# EAGLE design asaMain7_out4 (EAGLE 7.4.0)
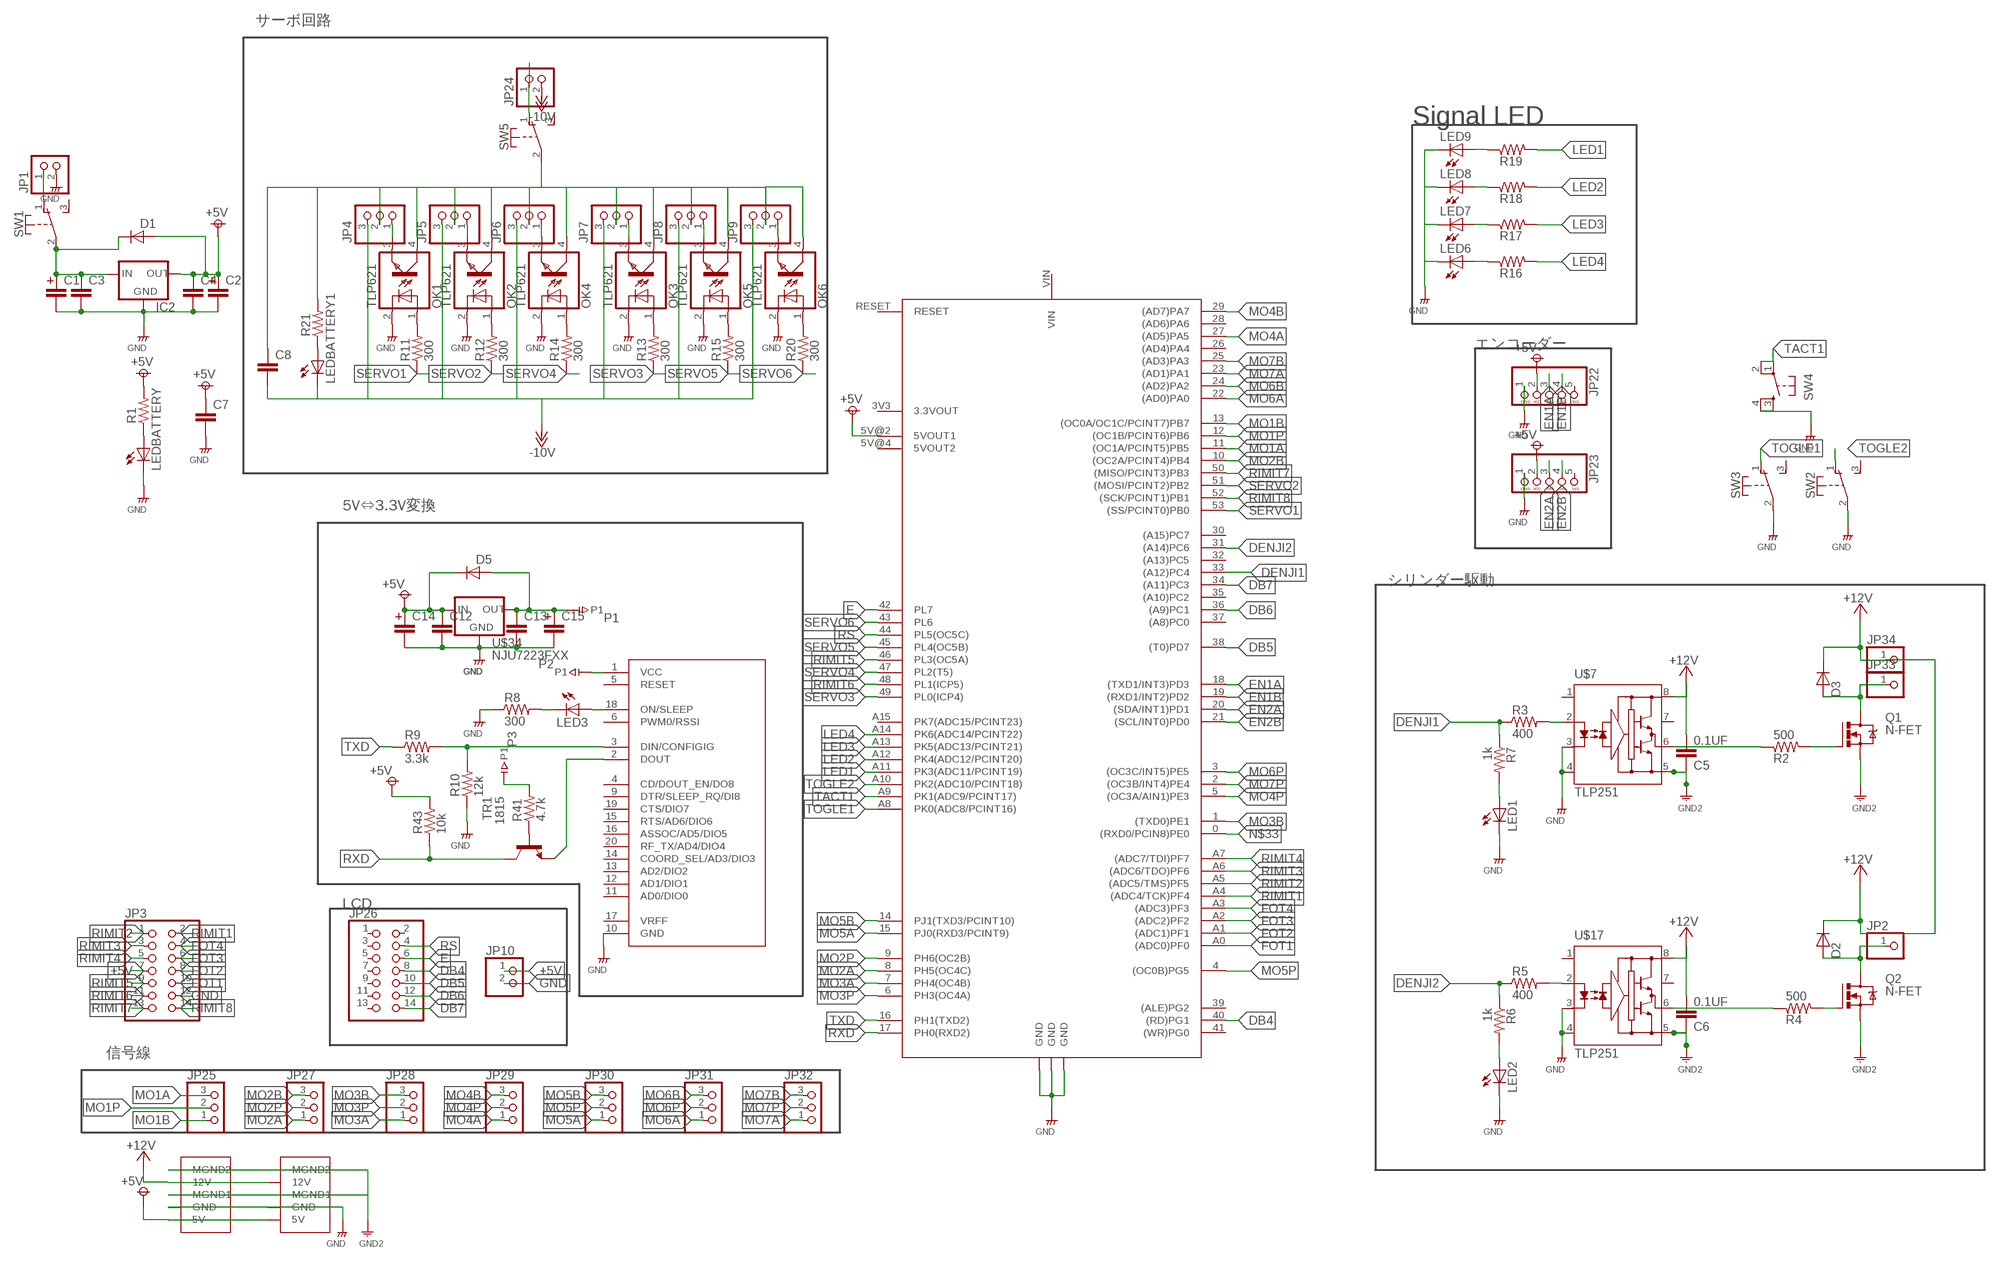
[diagram p0: schematic, sheet 1]

## Parts
AR1  ARUDUINO_MEGA_2560_R3  [ARUDUINO_MEGA_2560_R3]
C1  CAPACITOR-330U_SMD  [C_330U_SMD]
C2  CAPACITOR-330U_SMD  [C_330U_SMD]
C3  MLCC-3  [MLCC_50]
C4  MLCC-3  [MLCC_50]
C5  0.1UF  MLCC-3  [MLCC_50]
C6  0.1UF  MLCC-3  [MLCC_50]
C7  MLCC-3  [MLCC_50]
C8  MLCC-3  [MLCC_50]
C12  MLCC-3  [MLCC_50]
C13  MLCC-3  [MLCC_50]
C14  CAPACITOR-330U_SMD  [C_330U_SMD]
C15  CAPACITOR-330U_SMD  [C_330U_SMD]
D1  DIODE_3  [DIODE_3]
D2  DIODE_4  [DIODE_4]
D3  DIODE_4  [DIODE_4]
D5  DIODE_3  [DIODE_3]
IC2  78  [78XX]
JP1  PINHD-1X2"  [1*02]
JP2  PINHD-1X1  [1X01]
JP3  PINHD-2X7  [2X07]
JP4  PINHD-1X3-1  [1*03]
JP5  PINHD-1X3-1  [1*03]
JP6  PINHD-1X3-1  [1*03]
JP7  PINHD-1X3-1  [1*03]
JP8  PINHD-1X3-1  [1*03]
JP9  PINHD-1X3-1  [1*03]
JP10  PINHD-1X2"  [1*02]
JP22  PINHD-1X5-1  [1*05(KIKAKU)]
JP23  PINHD-1X5-1  [1*05(KIKAKU)]
JP24  PINHD-1X2"  [1*02]
JP25  PINHD-1X3-1  [1*03]
JP26  PINHD-2X7  [2X07]
JP27  PINHD-1X3-1  [1*03]
JP28  PINHD-1X3-1  [1*03]
JP29  PINHD-1X3-1  [1*03]
JP30  PINHD-1X3-1  [1*03]
JP31  PINHD-1X3-1  [1*03]
JP32  PINHD-1X3-1  [1*03]
JP33  PINHD-1X1  [1X01]
JP34  PINHD-1X1  [1X01]
LED1  LED3MM  [LED3MM]
LED2  LED3MM  [LED3MM]
LED3  LED3MM  [LED3MM]
LED6  LED3MM  [LED3MM]
LED7  LED3MM  [LED3MM]
LED8  LED3MM  [LED3MM]
LED9  LED3MM  [LED3MM]
LEDBATTERY  LED3MM_2  [LED3MM_2]
LEDBATTERY1  LED3MM  [LED3MM]
OK1  TLP621  [DIP4]
OK2  TLP621  [DIP4]
OK3  TLP621  [DIP4]
OK4  TLP621  [DIP4]
OK5  TLP621  [DIP4]
OK6  TLP621  [DIP4]
Q1  N-FET  [TO-220V]
Q2  N-FET  [TO-220V]
R1  RESISTORS3216  [3216]
R2  500  RESISTORS-3  [R_0.3]
R3  400  RESISTORS3216  [3216]
R4  500  RESISTORS-3  [R_0.3]
R5  400  RESISTORS3216  [3216]
R6  1k  RESISTORS3216  [3216]
R7  1k  RESISTORS3216  [3216]
R8  300  RESISTORS-3  [R_0.3]
R9  3.3k  RESISTORS4  [R_0.4]
R10  12k  RESISTORS4  [R_0.4]
R11  300  RESISTORS3216  [3216]
R12  300  RESISTORS3216  [3216]
R13  300  RESISTORS3216  [3216]
R14  300  RESISTORS3216  [3216]
R15  300  RESISTORS3216  [3216]
R16  RESISTORS3216  [3216]
R17  RESISTORS3216  [3216]
R18  RESISTORS3216  [3216]
R19  RESISTORS3216  [3216]
R20  300  RESISTORS3216  [3216]
R21  RESISTORS3216  [3216]
R41  4.7k  RESISTORS-3  [R_0.3]
R43  10k  RESISTORS-3  [R_0.3]
SW1  TOGGLE  [9450-2]
SW2  TOGGLE  [9450-2]
SW3  TOGGLE  [9450-2]
SW4  TACT  [1273]
SW5  TOGGLE  [9450-2]
TR1  1815  [GSPACE]
U$7  TLP251  [DIP8]
U$17  TLP251  [DIP8]
U$28  ASADORA2017A  [ASADORA2017A]
U$34  NJU7223FXX  [NJU7223FXX]
U$45  ASADORA2017A  [ASADORA2017A]
XB1  XBEE-  [XBEE-MAIN]

## Nets
3.3OUT: C13.1 C15.PLUS D5.A R41.2 U$34.P$1(OUT) XB1.1(VCC) ; supply symbol labelled CPIN
+5V: AR1.5V@2(5VOUT1) C2.PLUS C4.1 C7.1 C12.1 C14.PLUS D1.A D5.C IC2.P$3(OUT) JP3.7 JP10.1 JP22.2 JP23.2 R1.P$6 R43.2 U$28.5V U$34.P$2(IN) U$45.5V
+12V: C5.2 C6.2 D2.C D3.C JP34.1 U$7.8 U$17.8 U$28.12V U$45.12V
-10V: C8.2 JP4.3 JP5.3 JP6.3 JP7.3 JP8.3 JP9.3 JP24.2 LEDBATTERY1.K(C)
DB4: AR1.40((RD)PG1) JP26.8
DB5: AR1.38((T0)PD7) JP26.10
DB6: AR1.36((A9)PC1) JP26.12
DB7: AR1.34((A11)PC3) JP26.14
DENJI1: AR1.33((A12)PC4) R3.P$5 R7.P$5
DENJI2: AR1.31((A14)PC6) R5.P$5 R6.P$5
E: AR1.42(PL7) JP26.6
EN1A: AR1.18((TXD1/INT3)PD3) JP22.3
EN1B: AR1.19((RXD1/INT2)PD2) JP22.4
EN2A: AR1.20((SDA/INT1)PD1) JP23.3
EN2B: AR1.21((SCL/INT0)PD0) JP23.4
FOT1: AR1.A0((ADC0)PF0) JP3.10
FOT2: AR1.A1((ADC1)PF1) JP3.8
FOT3: AR1.A2((ADC2)PF2) JP3.6
FOT4: AR1.A3((ADC3)PF3) JP3.4
GND: AR1.GND@1(GND) AR1.GND@3(GND) AR1.GND@5(GND) C1.MINUS C2.MINUS C3.2 C4.2 C7.2 C12.2 C13.2 C14.MINUS C15.MINUS IC2.P$2(GND) JP1.2 JP3.12 JP10.2 JP22.1 JP23.1 LED1.K(C) LED2.K(C) LED6.K(C) LED7.K(C) LED8.K(C) LED9.K(C) LEDBATTERY.K(C) OK1.2(C) OK2.2(C) OK3.2(C) OK4.2(C) OK5.2(C) OK6.2(C) R8.1 R10.1 SW2.2(P) SW3.2(P) SW4.3(S) SW4.4(S1) U$7.3 U$7.4 U$17.3 U$17.4 U$28.GND U$34.P$3(GND) U$45.GND XB1.10(GND)
GND12: C5.1 C6.1 Q1.3(S) Q2.3(S) U$7.5 U$17.5 U$28.MGND1 U$28.MGND2 U$45.MGND1 U$45.MGND2 ; supply symbol labelled GND2
LED1: AR1.A11(PK3(ADC11/PCINT19)) R19.P$6
LED2: AR1.A12(PK4(ADC12/PCINT20)) R18.P$6
LED3: AR1.A13(PK5(ADC13/PCINT21)) R17.P$6
LED4: AR1.A14(PK6(ADC14/PCINT22)) R16.P$6
MO1A: AR1.11((OC1A/PCINT5)PB5) JP25.3
MO1B: AR1.13((OC0A/OC1C/PCINT7)PB7) JP25.1
MO1P: AR1.12((OC1B/PCINT6)PB6) JP25.2
MO2A: AR1.8(PH5(OC4C)) JP27.1
MO2B: AR1.10((OC2A/PCINT4)PB4) JP27.3
MO2P: AR1.9(PH6(OC2B)) JP27.2
MO3A: AR1.7(PH4(OC4B)) JP28.1
MO3B: AR1.1((TXD0)PE1) JP28.3
MO3P: AR1.6(PH3(OC4A)) JP28.2
MO4A: AR1.27((AD5)PA5) JP29.1
MO4B: AR1.29((AD7)PA7) JP29.3
MO4P: AR1.5((OC3A/AIN1)PE3) JP29.2
MO5A: AR1.15(PJ0(RXD3/PCINT9)) JP30.1
MO5B: AR1.14(PJ1(TXD3/PCINT10)) JP30.3
MO5P: AR1.4((OC0B)PG5) JP30.2
MO6A: AR1.22((AD0)PA0) JP31.1
MO6B: AR1.24((AD2)PA2) JP31.3
MO6P: AR1.3((OC3C/INT5)PE5) JP31.2
MO7A: AR1.23((AD1)PA1) JP32.1
MO7B: AR1.25((AD3)PA3) JP32.3
MO7P: AR1.2((OC3B/INT4)PE4) JP32.2
N$1: LED9.A R19.P$5
N$2: LED8.A R18.P$5
N$3: OK1.1(A) R11.P$6
N$4: JP1.1 SW1.1(O)
N$5: C1.PLUS C3.1 D1.C IC2.P$1(IN) SW1.2(P)
N$6: Q1.1(G) R2.2
N$8: Q2.1(G) R4.2
N$9: LED7.A R17.P$5
N$10: R3.P$6 U$7.2
N$11: R2.1 U$7.6
N$12: OK2.1(A) R12.P$6
N$13: LED1.A R7.P$6
N$15: R4.1 U$17.6
N$16: LEDBATTERY1.A R21.P$5
N$17: LED6.A R16.P$5
N$19: LED2.A R6.P$6
N$20: R5.P$6 U$17.2
N$21: D2.A JP2.1 Q2.2(D)
N$23: JP7.1 OK3.3(EMIT)
N$24: JP8.1 OK5.3(EMIT)
N$26: JP4.1 OK1.3(EMIT)
N$27: OK3.1(A) R13.P$6
N$28: JP5.1 OK2.3(EMIT)
N$29: OK5.1(A) R15.P$6
N$30: JP9.1 OK6.3(EMIT)
N$31: OK6.1(A) R20.P$6
N$32: JP6.1 OK4.3(EMIT)
N$33: AR1.0((RXD0/PCIN8)PE0)
N$34: OK4.1(A) R14.P$6
N$36: D3.A JP33.1 Q1.2(D)
N$40: LEDBATTERY.A R1.P$5
N$51: LED3.A XB1.18(ON/SLEEP)
N$54: LED3.K(C) R8.2
N$59: C8.1 JP4.2 JP5.2 JP6.2 JP7.2 JP8.2 JP9.2 OK1.4(COL) OK2.4(COL) OK3.4(COL) OK4.4(COL) OK5.4(COL) OK6.4(COL) R21.P$6 SW5.2(P)
N$68: R9.2 R10.2 XB1.3(DIN/CONFIGIG)
N$81: JP24.1 SW5.1(O)
N$103: R41.1 TR1.B
N$104: TR1.E XB1.2(DOUT)
RIMIT1: AR1.A4((ADC4/TCK)PF4) JP3.2
RIMIT2: AR1.A5((ADC5/TMS)PF5) JP3.1
RIMIT3: AR1.A6((ADC6/TDO)PF6) JP3.3
RIMIT4: AR1.A7((ADC7/TDI)PF7) JP3.5
RIMIT5: AR1.46(PL3(OC5A)) JP3.9
RIMIT6: AR1.48(PL1(ICP5)) JP3.11
RIMIT7: AR1.50((MISO/PCINT3)PB3) JP3.13
RIMIT8: AR1.52((SCK/PCINT1)PB1) JP3.14
RS: AR1.44(PL5(OC5C)) JP26.4
RXD: AR1.17(PH0(RXD2)) R43.1 TR1.C
SERVO1: AR1.53((SS/PCINT0)PB0) R11.P$5
SERVO2: AR1.51((MOSI/PCINT2)PB2) R12.P$5
SERVO3: AR1.49(PL0(ICP4)) R13.P$5
SERVO4: AR1.47(PL2(T5)) R14.P$5
SERVO5: AR1.45(PL4(OC5B)) R15.P$5
SERVO6: AR1.43(PL6) R20.P$5
TACT1: AR1.A9(PK1(ADC9/PCINT17)) SW4.1(P) SW4.2(P1)
TOGLE1: AR1.A8(PK0(ADC8/PCINT16)) SW3.1(O)
TOGLE2: AR1.A10(PK2(ADC10/PCINT18)) SW2.1(O)
TXD: AR1.16(PH1(TXD2)) R9.1
Unconnected: AR1.3V3(3.3VOUT) AR1.5V@4(5VOUT2) AR1.26((AD4)PA4) AR1.28((AD6)PA6) AR1.30((A15)PC7) AR1.32((A13)PC5) AR1.35((A10)PC2) AR1.37((A8)PC0) AR1.39((ALE)PG2) AR1.41((WR)PG0) AR1.A15(PK7(ADC15/PCINT23)) AR1.RESET AR1.VIN JP22.5 JP23.5 JP26.1 JP26.2 JP26.3 JP26.5 JP26.7 JP26.9 JP26.11 JP26.13 SW1.3(S) SW2.3(S) SW3.3(S) SW5.3(S) U$7.1 U$7.7 U$17.1 U$17.7 XB1.4(CD/DOUT_EN/DO8) XB1.5(RESET) XB1.6(PWM0/RSSI) XB1.9(DTR/SLEEP_RQ/DI8) XB1.11(AD0/DIO0) XB1.12(AD1/DIO1) XB1.13(AD2/DIO2) XB1.14(COORD_SEL/AD3/DIO3) XB1.15(RTS/AD6/DIO6) XB1.16(ASSOC/AD5/DIO5) XB1.17(VRFF) XB1.19(CTS/DIO7) XB1.20(RF_TX/AD4/DIO4)

## Notes on the sheet
- サーボ回路
- Signal LED
- エンコーダー
- 5V⇔3.3V変換
- シリンダー駆動
- LCD
- 信号線

## Library data of the parts
AR1 = aruduino:ARUDUINO_MEGA_2560_R3
C1 C2 C14 C15 = rcl__s:CAPACITOR
C3-C8 C12 C13 = rcl__s:MLCC: CAPACITOR, European symbol
D1-D3 D5 = diode_s:DIODE
IC2 = regulator_s:78*: VOLTAGE REGULATOR
JP1 JP10 JP24 = pinhead_s:PINHD-1X2: PIN HEADER
JP2 JP33 JP34 = pinhead_s:PINHD-1X1: PIN HEADER
JP3 JP26 = pinhead_s:PINHD-2X7: PIN HEADER
JP4-JP9 JP25 JP27-JP32 = pinhead_s:PINHD-1X3: PIN HEADER
JP22 JP23 = pinhead_s:PINHD-1X5: PIN HEADER
LED1-LED3 LED6-LED9 LEDBATTERY LEDBATTERY1 = LED_s:LED: LED OSRAM: - CHIPLED LG R971, LG N971, LY N971, LG Q971, LY Q971, LO R971, LY R971 LH N974, LH R974 LS Q976, LO Q976, LY Q976 LO Q996 - Hyper CHIPLED LW Q18S LB Q993, LB Q99A, LB R99A - SideLED LS A670, LO A670, LY A670, LG A670, LP A670 LB A673, LV A673, LT A673, LW A673 LH A674 LY A675 LS A676, LA A676, LO A676, LY A676, LW A676 LS A679, LY A679, LG A679 - Hyper Micro SIDELED® LS Y876, LA Y876, LO Y876, LY Y876 LT Y87S - SmartLED LW L88C, LW L88S LB L89C, LB L89S, LG L890 LS L89K, LO L89K, LY L89K LS L896, LA L896, LO L896, LY L896 - TOPLED LS T670, LO T670, LY T670, LG T670, LP T670 LSG T670, LSP T670, LSY T670, LOP T670, LYG T670 LG T671, LOG T671, LSG T671 LB T673, LV T673, LT T673, LW T673 LH T674 LS T676, LA T676, LO T676, LY T676, LB T676, LH T676, LSB T676, LW T676 LB T67C, LV T67C, LT T67C, LS T67K, LO T67K, LY T67K, LW E67C LS E67B, LA E67B, LO E67B, LY E67B, LB E67C, LV E67C, LT E67C LW T67C LS T679, LY T679, LG T679 LS T770, LO T770, LY T770, LG T770, LP T770 LB T773, LV T773, LT T773, LW T773 LH T774 LS E675, LA E675, LY E675, LS T675 LS T776, LA T776, LO T776, LY T776, LB T776 LHGB T686 LT T68C, LB T68C - Hyper Mini TOPLED® LB M676 - Mini TOPLED Santana® LG M470 LS M47K, LO M47K, LY M47K Source: http://www.osram.convergy.de - LUMILED® LXK2-PW12-R00, LXK2-PW12-S00, LXK2-PW14-U00, LXK2-PW14-V00 LXK2-PM12-R00, LXK2-PM12-S00, LXK2-PM14-U00 LXK2-PE12-Q00, LXK2-PE12-R00, LXK2-PE12-S00, LXK2-PE14-T00, LXK2-PE14-U00 LXK2-PB12-K00, LXK2-PB12-L00, LXK2-PB12-M00, LXK2-PB14-N00, LXK2-PB14-P00, LXK2-PB14-Q00 LXK2-PR12-L00, LXK2-PR12-M00, LXK2-PR14-Q00, LXK2-PR14-R00 LXK2-PD12-Q00, LXK2-PD12-R00, LXK2-PD12-S00 LXK2-PH12-R00, LXK2-PH12-S00 LXK2-PL12-P00, LXK2-PL12-Q00, LXK2-PL12-R00 Source: www.luxeon.com
OK1-OK6 = photocoupler_s:TLP621: SHARP OPTO COUPLER
Q1 Q2 = FET_s:N-FET
R1-R21 R41 R43 = rcl__s:RESISTORS
SW1-SW3 SW5 = switch_s:TOGGLE
SW4 = switch_s:TACT: OMRON SWITCH
TR1 = transistor_s:1815: NPN Transistor
U$7 U$17 = photocoupler_s:TLP251
U$28 U$45 = motadora2011:ASADORA2017A
U$34 = 3tannshi_s:NJU7223FXX
XB1 = Xbee_s:XBEE

## Board
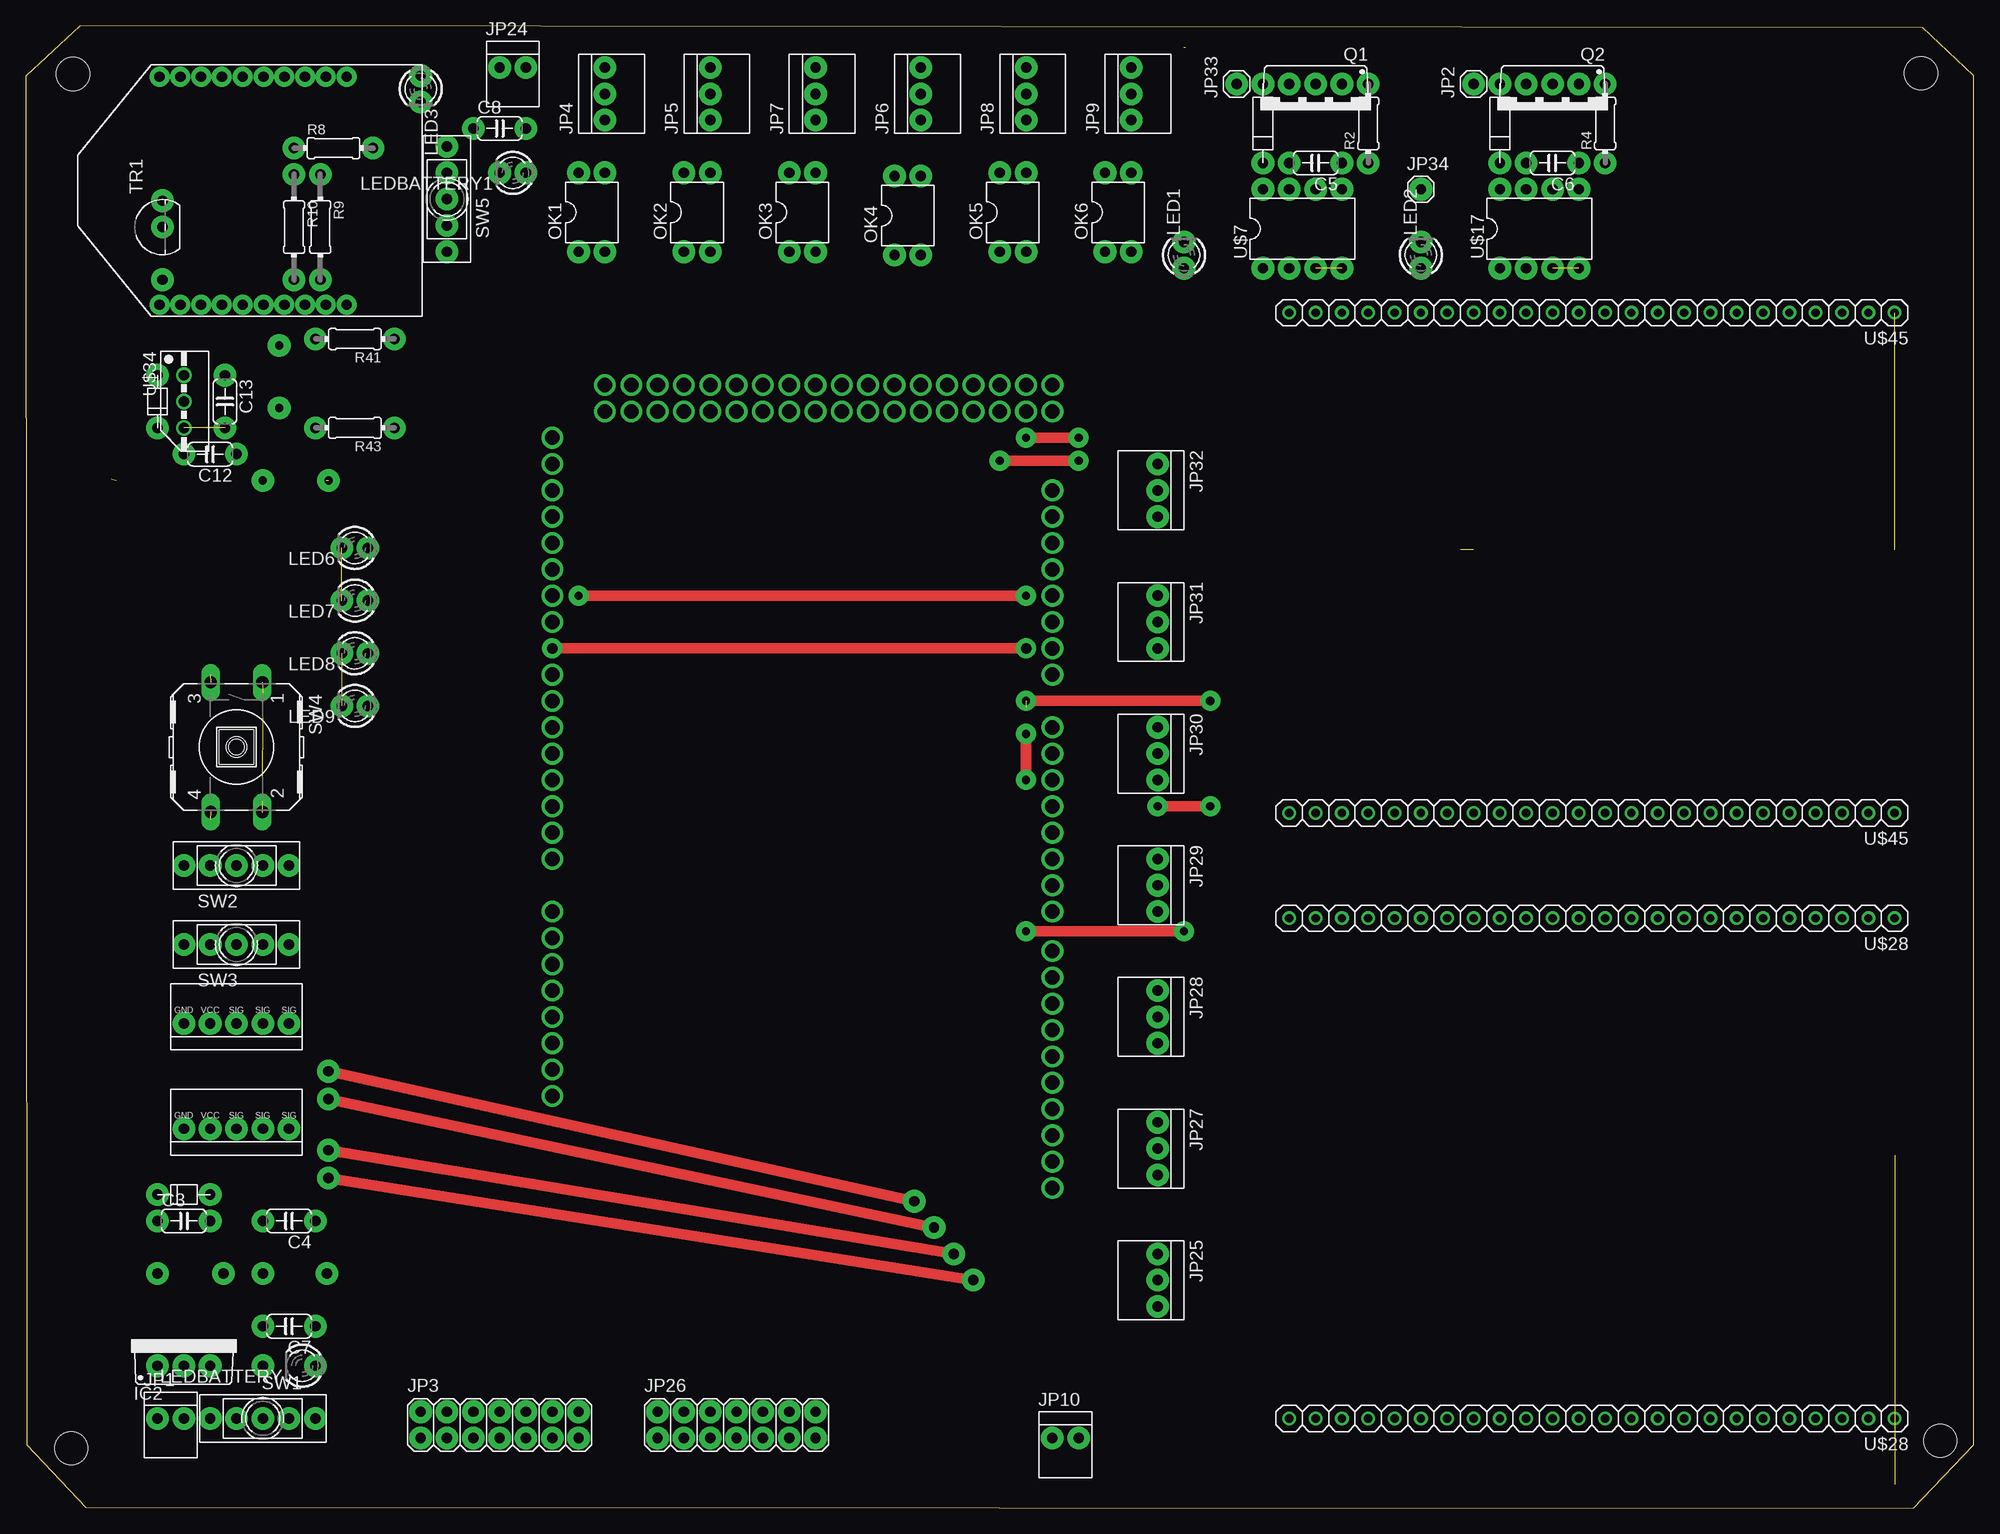
[diagram p1: board, top side]
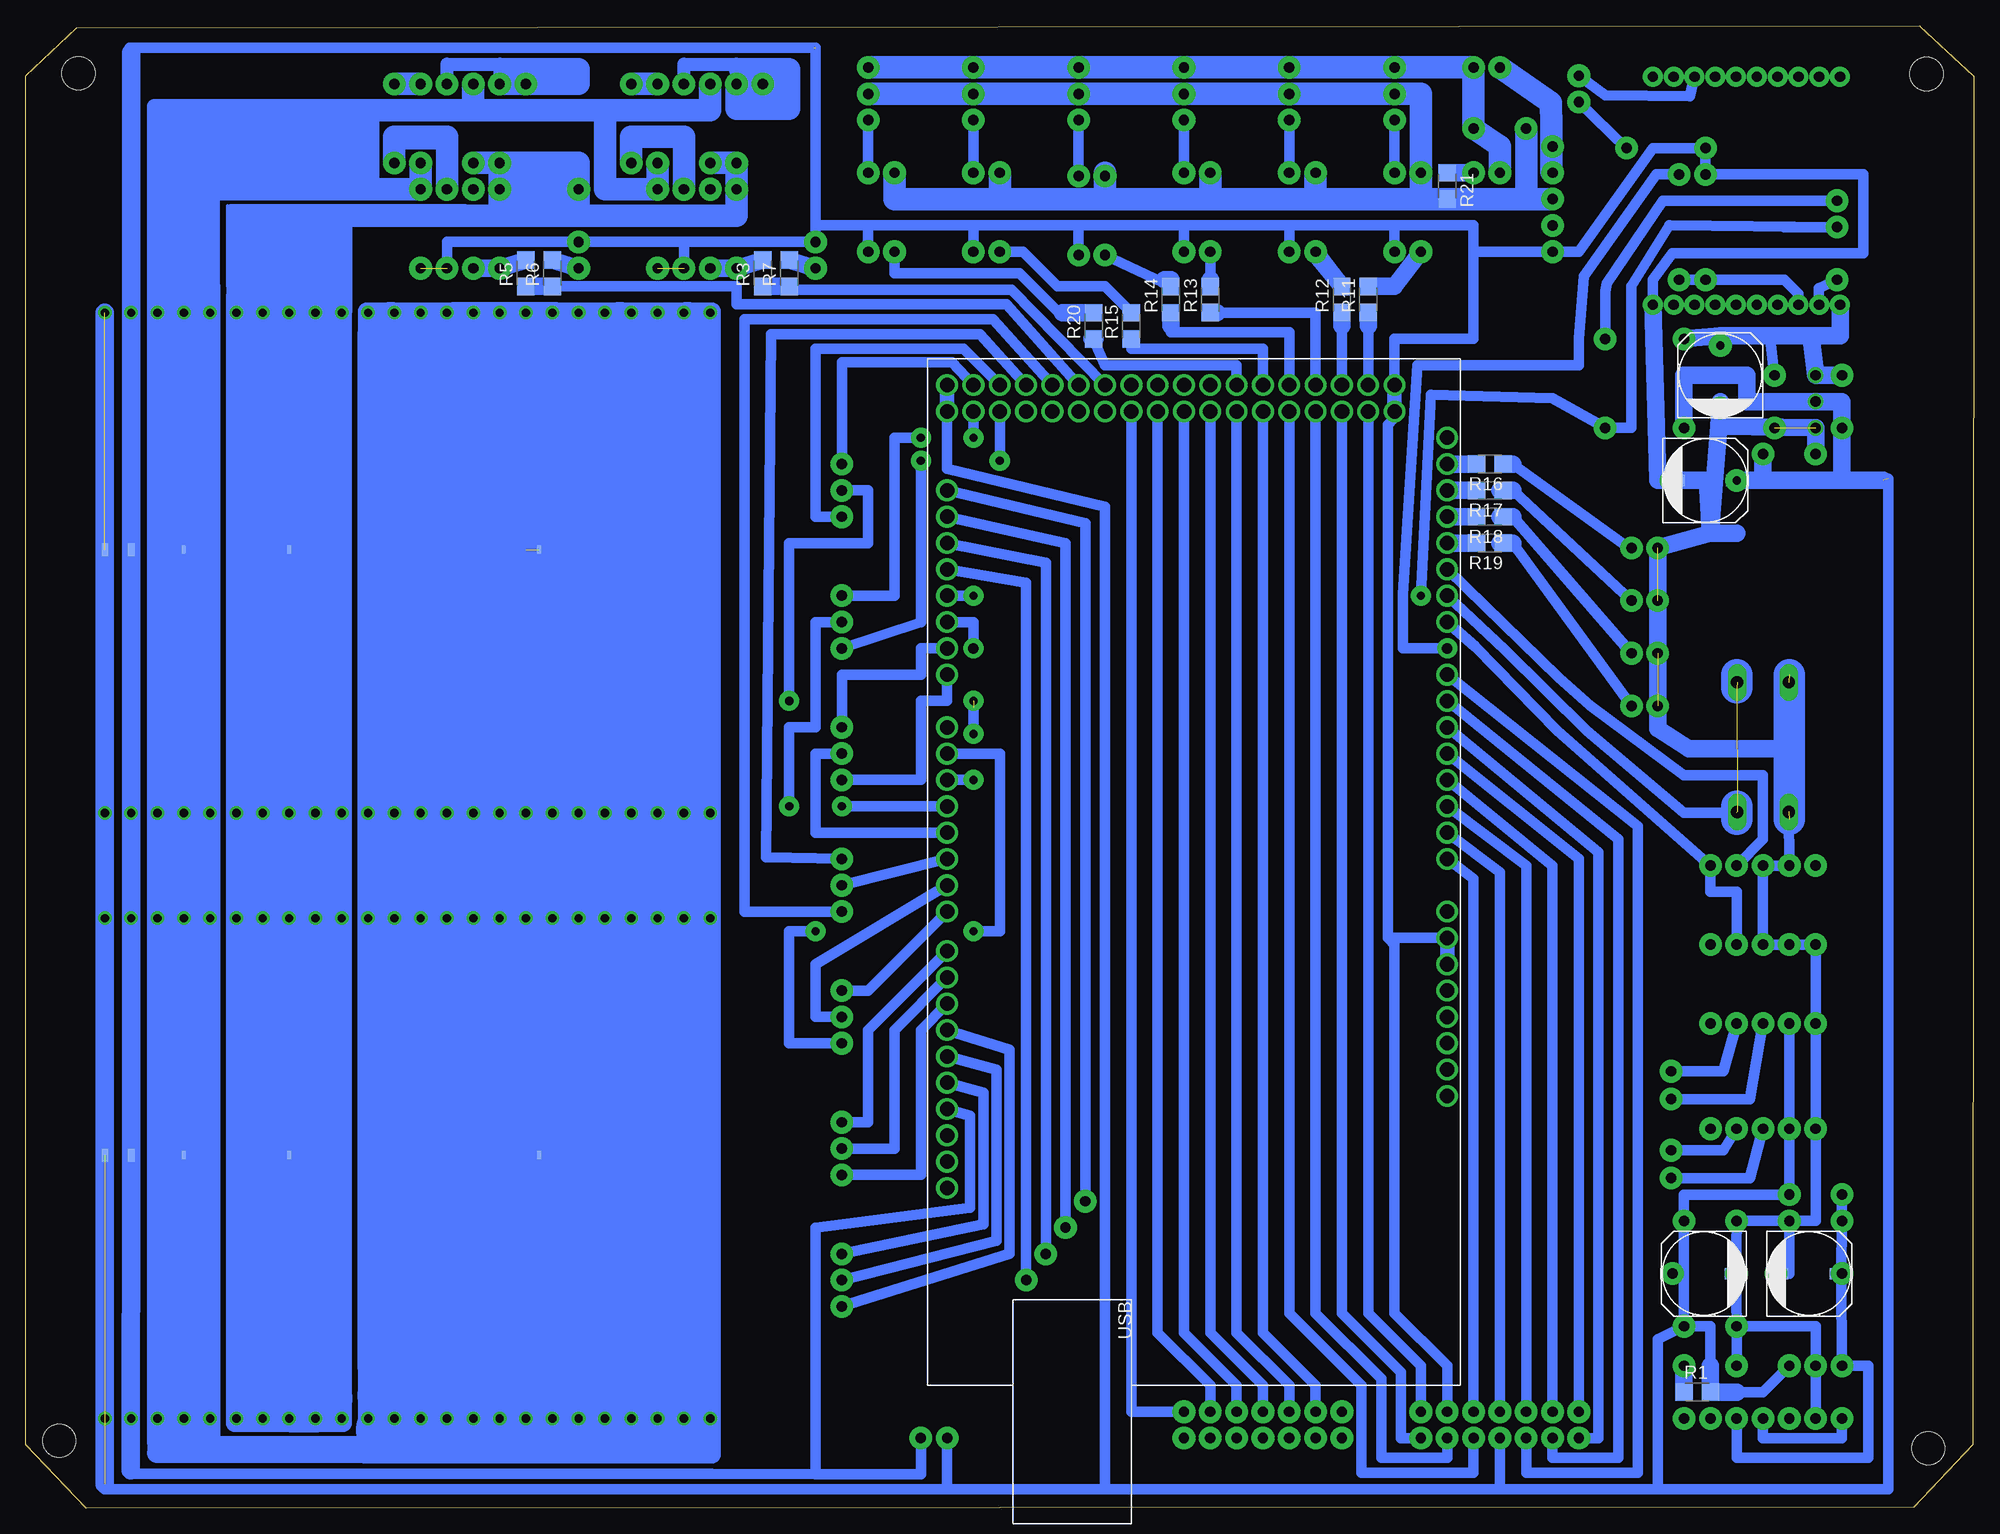
[diagram p2: board, bottom side, seen from below]

Size 187.96 x 143 mm. Coordinates in mm from the lower left corner, seen from the top.
Outline: 187.96,6.11 187.96,138.19 183.06,142.81 5.19,143 5.19,143 5.18,142.99 0.01,138.21 0,138.19 0.08,6.13 0.08,6.11 5.78,0.06 182.12,0 187.96,6.11
Copper layers (1*16): Top 0.035mm / dielectric 1.5mm / Bottom 0.035mm
Design rules "default": minimum track width 10mil, minimum drill 24mil, track to track 8mil, track to pad 8mil, pad to pad 8mil, via to via 8mil, smd to smd 8mil, copper to edge 40mil, drill to drill 8mil, minimum pad ring 10mil, minimum via ring 8mil, stop-mask expansion 4mil, vias tented up to drill 0mil, thermal gap 10mil
Holes 3.2 mm at 184.74,6.49 182.88,138.43 4.54,138.37 4.38,5.78

### Footprints (pad centres in the part's own frame; a part is rotated, then mirrored left to right if it is on the bottom)
ARUDUINO_MEGA_2560_R3 = drill 1.4: 0 12.7,25.4; 1 10.16,25.4; 2 7.62,25.4; 3 5.08,25.4; 3V3 -15.24,-22.86; 4 2.54,25.4; 5 0,25.4; 5V@1 43.18,25.4; 5V@2 45.72,25.4; 5V@3 -20.32,-22.86; 5V@4 -12.7,-22.86; 6 -2.54,25.4; 7 -5.08,25.4; 8 -8.89,25.4; 9 -11.43,25.4; 10 -13.97,25.4; 11 -16.51,25.4; 12 -19.05,25.4; 13 -21.59,25.4; 14 17.78,25.4; 15 20.32,25.4; 16 22.86,25.4; 17 25.4,25.4; 18 27.94,25.4; 19 30.48,25.4; 20 33.02,25.4; 21 35.56,25.4; 22 43.18,22.86; 23 45.72,22.86; 24 43.18,20.32; 25 45.72,20.32; 26 43.18,17.78; 27 45.72,17.78; 28 43.18,15.24; 29 45.72,15.24; 30 43.18,12.7; 31 45.72,12.7; 32 43.18,10.16; 33 45.72,10.16; 34 43.18,7.62; 35 45.72,7.62; 36 43.18,5.08; 37 45.72,5.08; 38 43.18,2.54; 39 45.72,2.54; 40 43.18,0; 41 45.72,0; 42 43.18,-2.54; 43 45.72,-2.54; 44 43.18,-5.08; 45 45.72,-5.08; 46 43.18,-7.62; 47 45.72,-7.62; 48 43.18,-10.16; 49 45.72,-10.16; 50 43.18,-12.7; 51 45.72,-12.7; 52 43.18,-15.24; 53 45.72,-15.24; A0 0,-22.86; A1 2.54,-22.86; A2 5.08,-22.86; A3 7.62,-22.86; A4 10.16,-22.86; A5 12.7,-22.86; A6 15.24,-22.86; A7 17.78,-22.86; A8 22.86,-22.86; A9 25.4,-22.86; A10 27.94,-22.86; A11 30.48,-22.86; A12 33.02,-22.86; A13 35.56,-22.86; A14 38.1,-22.86; A15 40.64,-22.86; AREF -26.67,25.4; GND@1 -10.16,-22.86; GND@2 -7.62,-22.86; GND@3 43.18,-17.78; GND@4 45.72,-17.78; GND@5 -24.13,25.4; NOTHING -22.86,-22.86; PD0 -31.75,25.4; PD1 -29.21,25.4; RESET -17.78,-22.86; VIN -5.08,-22.86
C_330U_SMD = smd 1.067 x 2.184: MINUS 0,-3.1; PLUS 0,3.1
MLCC_50 = drill 1 pad 2.184: 1 -2.54,0; 2 2.54,0
DIODE_3 = drill 1 pad 2.184: A -2.54,0; C 2.54,0
DIODE_4 = drill 1 pad 2.184: A -5.08,0; C 2.54,0
78XX = drill 1 pad 2.184: P$1 -2.54,0; P$2 0,0; P$3 2.54,0
1*02 = drill 1 pad 2.184: 1 -1.27,0; 2 1.27,0
1X01 = drill 1 pad 2.184: 1 0,0
2X07 = drill 1 pad 2.184: 1 -7.62,-1.27; 2 -7.62,1.27; 3 -5.08,-1.27; 4 -5.08,1.27; 5 -2.54,-1.27; 6 -2.54,1.27; 7 0,-1.27; 8 0,1.27; 9 2.54,-1.27; 10 2.54,1.27; 11 5.08,-1.27; 12 5.08,1.27; 13 7.62,-1.27; 14 7.62,1.27
1*03 = drill 1 pad 2.184: 1 -2.54,0; 2 0,0; 3 2.54,0
1*05(KIKAKU) = drill 1 pad 2.184: 1 5.08,0; 2 2.54,0; 3 0,0; 4 -2.54,0; 5 -5.08,0
LED3MM = drill 1 pad 2.184: A -1.27,0; K 1.27,0
LED3MM_2 = drill 1 pad 2.184: A -2.54,0; K 2.54,0
DIP4 = drill 1 pad 2.184: 1 -1.27,-3.81; 2 1.27,-3.81; 3 1.27,3.81; 4 -1.27,3.81
TO-220V = drill 1 pad 2.184: 1 -2.54,0; 2 0,0; 3 2.54,0
3216 = smd 1.676 x 1.676: P$5 0,0; P$6 2.54,0
R_0.3 = drill 1 pad 2.184: 1 -3.81,0; 2 3.81,0; 3 -3.81,0
R_0.4 = drill 1 pad 2.184: 1 -5.08,0; 2 5.08,0
9450-2 = drill 1 pad 2.184: 1 -2.54,0; 2 0,0; 3 2.54,0; F1 -5.08,0; F2 5.08,0
1273 = drill 1.194 long: 1 -6.248,2.489; 2 6.248,2.489; 3 -6.248,-2.489; 4 6.248,-2.489
GSPACE = drill 1 pad 2.184: B 2.54,0; C 0,0; E -5.08,0
DIP8 = drill 1 pad 2.184: 1 -3.81,-3.81; 2 -1.27,-3.81; 3 1.27,-3.81; 4 3.81,-3.81; 5 3.81,3.81; 6 1.27,3.81; 7 -1.27,3.81; 8 -3.81,3.81
ASADORA2017A = smd 1.27 x 0.635 bottom: 5V 0,-30.48; GND 0,-27.94 | smd 0.813 x 0.406 bottom: 12V 0,-12.7; MGND1 0,-22.86; MGND2 0,11.43 | drill 0.8: P$1 -25.4,-22.86; P$2 -25.4,-17.78; P$3 -25.4,-15.24; P$4 -25.4,-12.7; P$5 -25.4,-10.16; P$6 -25.4,-27.94; P$7 -25.4,-30.48; P$8 22.86,-27.94; P$9 22.86,-30.48; P$10 -25.4,-5.08; P$11 -25.4,-2.54; P$12 -25.4,0; P$13 -25.4,2.54; P$14 -25.4,5.08; P$15 -25.4,7.62; P$16 -25.4,10.16; P$17 -25.4,12.7; P$18 -25.4,15.24; P$19 -25.4,17.78; P$20 -25.4,20.32; P$21 -25.4,22.86; P$22 -25.4,20.32; P$23 -25.4,22.86; P$24 -25.4,25.4; P$26 22.86,-25.4; P$27 22.86,-22.86; P$28 22.86,-17.78; P$29 22.86,-15.24; P$30 22.86,-12.7; P$31 22.86,-10.16; P$32 22.86,-5.08; P$33 22.86,-2.54; P$34 -25.4,-25.4; P$35 22.86,0; P$36 22.86,2.54; P$37 22.86,5.08; P$38 22.86,7.62; P$39 22.86,10.16; P$40 22.86,12.7; P$41 22.86,15.24; P$42 22.86,17.78; P$43 22.86,20.32; P$44 22.86,22.86; P$45 22.86,20.32; P$46 22.86,22.86; P$47 22.86,25.4; SS1 -25.4,-22.86; SS2 -25.4,-20.32; SS3 -25.4,-15.24; SS4 -25.4,-12.7; SS5 -25.4,-10.16; SS6 -25.4,-7.62; SS11 -25.4,-2.54; SS12 -25.4,0; SS13 -25.4,2.54; SS14 -25.4,5.08; SS15 -25.4,7.62; SS16 -25.4,10.16; SS17 -25.4,12.7; SS18 -25.4,15.24; SS19 -25.4,17.78; SS20 -25.4,20.32; SS21 -25.4,22.86; SS22 -25.4,25.4; SS23 -25.4,22.86; SS24 -25.4,25.4; SS25 -25.4,27.94; SS27 22.86,-22.86; SS28 22.86,-20.32; SS29 22.86,-15.24; SS30 22.86,-12.7; SS31 22.86,-10.16; SS32 22.86,-7.62; SS33 22.86,-2.54; SS34 22.86,0; SS35 22.86,2.54; SS36 22.86,5.08; SS37 22.86,7.62; SS38 22.86,10.16; SS39 22.86,12.7; SS40 22.86,15.24; SS41 22.86,17.78; SS42 22.86,20.32; SS43 22.86,22.86; SS44 22.86,25.4; SS45 22.86,22.86; SS46 22.86,25.4; SS47 22.86,27.94
NJU7223FXX = drill 1: P$1 -2.54,0; P$2 0,0; P$3 2.54,0
XBEE-MAIN = drill 1 pad 1.93: 1 1.118,25.349; 2 1.118,23.343; 3 1.118,21.336; 4 1.118,19.329; 5 1.118,17.323; 6 1.118,15.316; 7 1.118,13.31; 8 1.118,11.303; 9 1.118,9.296; 10 1.118,7.29; 11 23.114,25.349; 12 23.114,23.343; 13 23.114,21.336; 14 23.114,19.329; 15 23.114,17.323; 16 23.114,15.316; 17 23.114,13.31; 18 23.114,11.303; 19 23.114,9.296; 20 23.114,7.29

### Placement (x,y rotation side)
AR1  73.66,62.63 90 bottom
C1  15.88,22.62 270 bottom
C2  26.03,22.62 90 bottom
C3  15.24,27.7 0 top
C4  25.4,27.7 180 top
C5  124.46,129.78 180 top
C6  147.32,129.78 180 top
C7  25.4,17.54 180 top
C8  45.72,133.11 0 top
C12  17.78,101.68 180 top
C13  19.21,106.76 270 top
C14  25.88,99.14 270 bottom
C15  24.45,109.3 0 bottom
D1  15.24,30.24 180 top
D2  142.24,132.32 270 top
D3  119.38,132.32 270 top
D5  12.7,106.76 270 top
IC2  15.24,13.73 0 top
JP1  13.97,8.65 0 top
JP2  139.7,137.4 90 top
JP3  45.72,8.02 0 top
JP4  55.88,136.45 90 top
JP5  66.04,136.45 90 top
JP6  86.36,136.45 90 top
JP7  76.2,136.45 90 top
JP8  96.52,136.45 90 top
JP9  106.68,136.45 90 top
JP10  100.33,6.75 0 top
JP22  20.32,36.59 180 top
JP23  20.32,46.75 180 top
JP24  46.99,138.99 0 top
JP25  109.22,21.99 270 top
JP26  68.58,8.02 0 top
JP27  109.22,34.69 270 top
JP28  109.22,47.39 270 top
JP29  109.22,60.09 270 top
JP30  109.22,72.79 270 top
JP31  109.22,85.49 270 top
JP32  109.22,98.19 270 top
JP33  116.84,137.4 90 top
JP34  134.62,127.24 0 top
LED1  111.76,120.89 90 top
LED2  134.62,120.89 90 top
LED3  38.1,136.92 270 top
LED6  31.75,92.63 180 top
LED7  31.75,87.55 180 top
LED8  31.75,82.47 180 top
LED9  31.75,77.39 180 top
LEDBATTERY  25.4,13.73 180 top
LEDBATTERY1  46.99,128.83 180 top
OK1  54.61,125.02 0 top
OK2  64.77,125.02 0 top
OK3  74.93,125.02 0 top
OK4  85.09,124.7 0 top
OK5  95.25,125.02 0 top
OK6  105.41,125.02 0 top
Q1  124.46,137.4 180 top
Q2  147.32,137.4 180 top
R1  27.94,11.19 0 bottom
R2  129.54,133.59 90 top
R3  116.84,117.87 90 bottom
R4  152.4,133.59 90 top
R5  139.7,117.87 90 bottom
R6  137.16,117.87 90 bottom
R7  114.3,117.87 90 bottom
R8  29.69,131.21 0 top
R9  28.42,123.59 270 top
R10  25.88,123.59 270 top
R11  58.42,115.33 90 bottom
R12  60.96,115.33 90 bottom
R13  73.66,115.33 90 bottom
R14  77.47,115.32 90 bottom
R15  81.28,112.79 90 bottom
R16  45.4,100.73 180 bottom
R17  45.4,98.19 180 bottom
R18  45.4,95.65 180 bottom
R19  45.4,93.11 180 bottom
R20  84.93,112.79 90 bottom
R21  50.8,128.83 270 bottom
R41  31.75,112.79 180 top
R43  31.75,104.22 180 top
SW1  22.86,8.65 0 top
SW2  20.32,61.99 180 top
SW3  20.32,54.37 180 top
SW4  20.32,73.42 270 top
SW5  40.64,126.29 270 top
TR1  13.18,123.59 90 top
U$7  123.19,123.43 0 top
U$17  146.05,123.43 0 top
U$28  149.86,34.05 90 top
U$34  15.24,106.76 270 top
U$45  149.86,92.47 90 top
XB1  38.24,114.98 90 top

### Tracks (layer width: path | path; a pad name or v marks a point on that pad's centre or on a via)
3.3OUT
  Bottom 0.406: 24.45,113.11 C15.PLUS
  Bottom 1.016: 13.18,113.11 13.18,115.71 XB1.1 | C13.1 19.69,113.11
  Bottom 1.676: R41.2 24.45,113.11 19.69,113.11 15.72,113.11 | 15.72,113.11 13.18,113.11 12.86,113.11 12.86,115.97 | 15.72,113.11 U$34.P$1 D5.A
+5V  (via drill 0.8 pad 2.18)  (3 unrouted)
  Bottom 1.016: 21.91,106.76 U$34.P$2 12.7,106.76 D5.C 12.7,99.14 20.32,99.14 C14.PLUS | 99.06,105.81 99.06,100.25 83.82,96.6 83.82,1.83 | 83.82,1.83 45.72,1.83 | 45.72,1.83 30.48,1.83 | 83.82,1.83 99.06,1.83 | 27.94,22.62 C4.1 27.94,30.24 D1.A JP22.2 JP23.2 | C2.PLUS 27.94,22.62 | 27.94,22.62 C7.1 | 25.4,13.73 25.4,17.54 C7.1 | 22.86,11.19 20.32,11.19 IC2.P$3 | 30.48,1.83 30.48,16.27 C7.1 | JP3.7 45.72,1.83 | JP10.1 99.06,1.83 | 30.48,1.83 8.25,1.83 8.21,99.29 | 180.34,2.3 180.34,1.83 99.06,1.83
  Bottom 1.676: 22.86,11.19 R1.P$6 25.4,13.73 | R43.2 27.94,109.3 21.91,109.3 21.91,106.76 12.7,106.76 12.7,99.14 | 12.7,99.14 v22.86,99.14 20.32,99.14 C12.1 | 12.7,99.14 8.73,99.14
  Bottom 1.778: 180.34,2.3 180.34,115.33
+12V
  Bottom 0.305: 162.56,124.7 162.56,125.65 168.27,125.65 168.43,125.49 168.43,119.78
  Bottom 1.016: U$45.12V 162.56,122.16 162.56,124.7
  Bottom 1.676: 137.16,124.7 137.16,129.14 135.89,129.14 135.89,125.97
  Bottom 2.184: 162.56,124.7 142.24,124.7 | 142.24,124.7 139.7,124.7 | 134.62,124.7 119.38,124.7 U$7.8 D3.C C5.2 | U$17.8 142.24,124.7 | D2.C U$17.8 | 138.43,129.78 139.7,129.78 | 139.7,129.78 139.7,124.7 | 139.7,124.7 U$17.8 | U$17.8 139.7,129.78 | 139.7,129.78 139.75,129.52 139.11,127.62 139.7,124.7 | 139.7,124.7 138.43,124.7 | 138.43,129.78 134.62,129.78 JP34.1 134.62,124.7 | 138.43,129.78 138.43,124.7 | 138.43,124.7 137.16,124.7 134.62,124.7 | C6.2 139.7,129.78
  Bottom 6.452: 162.56,122.16 U$28.12V 162.56,10.56 159.7,10.56 159.7,122.48 165.42,122.48 165.42,10.87
-10V
  Bottom 1.676: JP5.3 JP6.3
  Bottom 2.184: LEDBATTERY1.K 45.72,131.37 C8.2 JP24.2 JP4.3 JP5.3 JP7.3 JP6.3 JP8.3 JP9.3
DB4
  Bottom 1.016: JP26.8 68.58,11.83 73.66,16.91 AR1.40
DB5
  Bottom 1.016: JP26.10 71.12,11.83 76.2,16.91 AR1.38
DB6
  Bottom 1.016: JP26.12 73.66,11.83 78.74,16.91 AR1.36
DB7
  Bottom 1.016: AR1.34 81.28,9.29 JP26.14
DENJI1
  Bottom 1.016: AR1.33 92.87,117.55 114.3,117.55 R7.P$5
  Bottom 1.676: R3.P$5 R7.P$5
DENJI2
  Bottom 1.016: AR1.31 93.34,116.13 119.38,116.13 119.38,117.87 R6.P$5
  Bottom 1.676: R5.P$5 R6.P$5
E
  Bottom 1.016: JP26.6 66.04,11.83 71.12,16.91 AR1.42
EN1A  (via drill 1 pad 2.18)
  Top 1.016: v91.44,21.99 v29.21,31.83
  Bottom 1.016: AR1.18 91.44,89.3 v91.44,21.99 | v29.21,31.83 21.59,31.83 JP22.3
EN1B  (via drill 1 pad 2.18)
  Top 1.016: v89.53,24.53 v29.21,34.53
  Bottom 1.016: AR1.19 89.53,91.2 v89.53,24.53 | v29.21,34.53 24.13,34.53 JP22.4
EN2A  (via drill 1 pad 2.18)
  Top 1.016: v87.63,27.07 v29.21,39.45
  Bottom 1.016: AR1.20 87.63,93.11 v87.63,27.07 | v29.21,39.45 21.59,39.45 JP23.3
EN2B  (via drill 1 pad 2.18)
  Top 1.016: v85.72,29.61 v29.21,42.15
  Bottom 1.016: AR1.21 85.72,95.01 v85.72,29.61 | v29.21,42.15 24.13,42.15 JP23.4
FOT1
  Bottom 1.016: AR1.A0 48.26,60.72 JP3.10
FOT2
  Bottom 1.016: AR1.A1 45.72,61.36 JP3.8
FOT3
  Bottom 1.016: AR1.A2 43.18,61.99 JP3.6
FOT4
  Bottom 1.016: AR1.A3 40.64,61.99 JP3.4
GND  (via drill 0.8 pad 2.18)  (9 unrouted)
  Bottom 1.016: OK6.2 106.68,123.75 | 124.46,122.16 LED1.K 111.76,123.75 | 106.68,123.75 96.52,123.75 | 96.52,123.75 86.36,123.75 | 86.36,123.75 76.2,123.75 | 76.2,123.75 66.04,123.75 | 66.04,123.75 55.88,123.75 | 55.88,123.75 48.26,123.75 48.26,121.21 | 48.26,121.21 48.26,112.79 55.88,112.79 55.88,108.35 | AR1.GND@5 96.84,37.86 96.84,28.97 111.76,27.07 111.76,3.25 | 111.76,3.25 121.81,3.32 177.64,3.32 177.8,3.57 177.85,3.57 177.85,3.63 | 24.61,104.38 v24.45,106.12 C15.MINUS | XB1.10 30.49,104.23 30.48,101.68 30.48,99.14 v29.21,99.14 25.72,99.14 | AR1.GND@3 55.88,105.17 56.51,104.54 56.51,55.01 | 56.51,55.01 50.8,55.01 | U$17.3 147.32,122.16 LED2.K 124.46,122.16 | U$7.3 124.46,122.16 | OK5.2 96.52,123.75 | JP3.12 50.8,13.73 55.88,18.81 55.88,54.37 56.51,55.01 | SW4.4 17.78,61.99 SW2.2 SW3.2 15.24,54.37 JP23.1 JP22.1 15.24,27.7 C3.2 | C3.2 C4.2 C2.MINUS C7.2 | C3.2 17.78,22.62 C1.MINUS | JP1.2 IC2.P$2 15.24,17.54 C7.2 | LEDBATTERY.K C7.2 | JP10.2 101.6,3.25 111.76,3.25 | 30.96,115.97 30.96,116.28 30.96,118.51 29.05,121.05 10.64,121.05 10.64,128.67 R10.1 R8.1 30.96,131.21 38.1,121.21 48.26,121.21 | OK3.2 76.2,123.75 | OK2.2 66.04,123.75 | OK4.2 86.36,123.75 | 111.76,123.75 106.68,123.75 | 111.76,123.75 111.76,140.89 | OK1.2 55.88,123.75 | 177.8,140.41 177.96,140.89 111.92,140.89
  Bottom 1.676: C12.2 U$34.P$3 24.61,104.38 | 24.61,104.38 24.45,106.76 | 24.61,104.38 25.4,94.06 | 30.96,116.28 30.48,99.14 25.72,99.14 25.4,94.06 | 22.86,94.06 25.4,94.06 | 25.4,94.06 LED6.K LED9.K 30.48,75.17 27.46,73.26 17.78,73.26
  Bottom 1.778: 177.85,3.63 U$28.GND U$45.GND 177.8,140.41
  Bottom 3.048: 17.78,80.41 17.78,73.26 17.78,66.44
GND12  (1 unrouted)
  Bottom 0.305: 169.7,126.29 149.86,126.29 U$17.5 150.18,127.24 150.97,126.44 150.65,126.44 150.34,126.76
  Bottom 1.016: 172.72,8.65 172.72,6.11 | 139.7,6.11 139.7,34.05 139.7,36.59 | 139.7,36.59 U$28.MGND2 | 139.7,36.59 139.7,92.47 137.16,92.47
  Bottom 1.27: 172.72,8.65 172.72,5.44 172.8,5.37 139.79,5.37 139.79,5.4 | 139.79,5.4 139.79,115.46 139.81,115.47 | 175.26,6.11 175.59,6.11 175.62,6.14 175.62,135.25 175.66,135.29 175.64,135.29 | 175.64,135.29 169.58,135.29 169.56,135.3 175.62,135.3 175.64,135.29 | 175.64,135.29 175.64,5.35 175.31,5.33 | 139.86,5.33 139.79,5.4
  Bottom 1.676: 172.72,6.11 139.7,6.11
  Bottom 1.93: 175.31,5.33 139.86,5.33
  Bottom 2.184: U$45.MGND1 172.72,132.64 172.72,134.86 154.94,134.86 | 154.94,134.86 144.78,134.86 | 144.78,134.86 132.08,134.86 | 132.08,134.86 121.92,134.86 Q1.3 | C6.1 U$17.5 154.94,127.24 | C5.1 U$7.5 132.08,127.24 132.08,134.86 | 154.94,127.24 154.94,134.86 | 157.48,127.24 154.94,127.24 | 144.78,134.86 Q2.3
  Bottom 6.452: 157.16,132.64 172.72,132.64 U$28.MGND1 172.72,8.65 172.72,8.14 172.88,7.98 | 139.7,34.05 139.7,113.11 | 137,113.11 130.65,113.11 | 130.65,113.11 124.14,113.11 124.14,10.87 | 124.14,10.87 130.65,10.87 | 137,10.87 152.72,10.87 | 152.72,13.73 152.72,113.11 146.53,113.11 | 130.65,113.11 130.65,10.87 | 130.65,10.87 137,10.87 | 137,10.87 137,113.11 | 139.7,113.11 146.53,113.11 | 146.53,113.11 146.53,14.37 146.69,14.21 142.88,14.21 142.56,14.53 142.56,108.51 142.08,108.98 | 152.4,13.73 152.72,13.73 | 152.72,10.87 152.72,7.7 152.88,7.54 124.14,7.54 124.14,10.87 | 137,113.11 139.7,113.11 | 152.72,13.73 152.72,10.87
LED1
  Bottom 1.016: 48.26,93.11 R19.P$6
  Bottom 1.676: AR1.A11 48.26,93.11
LED2
  Bottom 1.676: AR1.A12 R18.P$6
LED3
  Bottom 1.676: AR1.A13 R17.P$6
LED4
  Bottom 1.676: AR1.A14 R16.P$6
MO1A
  Bottom 1.016: JP25.3 93.03,24.55 93.03,44.21 AR1.11
MO1B
  Bottom 1.016: AR1.13 95.57,40.08 95.57,27.39 JP25.1
MO1P
  Bottom 1.016: AR1.12 94.3,42.31 94.3,25.81 JP25.2
MO2A
  Bottom 1.016: AR1.8 106.68,46.12 106.68,37.23 JP27.1
MO2B
  Bottom 1.016: AR1.10 101.6,46.12 101.6,32.15 JP27.3
MO2P
  Bottom 1.016: AR1.9 104.14,46.12 104.14,34.69 JP27.2
MO3A
  Bottom 1.016: AR1.7 106.68,49.93 JP28.1
MO3B  (via drill 0.8 pad 1.93)
  Top 1.016: v96.52,55.64 v111.76,55.64
  Bottom 1.016: AR1.1 93.98,72.79 93.98,55.64 v96.52,55.64 | JP28.3 114.3,44.85 114.3,55.64 v111.76,55.64
MO3P
  Bottom 1.016: AR1.6 111.76,52.47 111.76,47.39 JP28.2
MO4A
  Bottom 1.016: JP29.1 116.52,62.79 116.05,113.27 95.88,113.27 AR1.27
MO4B
  Bottom 1.016: AR1.29 94.61,114.7 118.59,114.7 118.59,57.55 JP29.3
MO4P
  Bottom 1.016: AR1.5 JP29.2
MO5A
  Bottom 1.016: JP30.1 109.22,80.41 101.6,80.41 101.6,82.95 AR1.15
MO5B
  Bottom 1.016: AR1.14 99.06,77.87 101.6,77.87 101.6,70.25 JP30.3
MO5P
  Bottom 1.016: AR1.4 111.76,65.17 111.76,72.79 JP30.2
MO6A  (via drill 0.8 pad 1.93)
  Top 1.016: v101.6,103.27 v96.52,103.27
  Bottom 1.016: JP31.1 104.14,88.03 104.14,103.27 v101.6,103.27 | v96.52,103.27 AR1.22
MO6B  (via drill 0.8 pad 1.93)
  Top 1.016: v101.6,101.04 v93.98,101.04
  Bottom 1.016: JP31.3 101.6,85.49 v101.6,101.04 | v93.98,101.04 AR1.24
MO6P  (via drill 0.8 pad 1.93)
  Top 1.016: v109.22,67.71 v114.3,67.71
  Bottom 1.016: AR1.3 v109.22,67.71 | JP31.2 111.76,85.49 111.76,75.33 114.3,75.33 v114.3,67.71
MO7A
  Bottom 1.016: JP32.1 109.22,110.57 98.58,110.57 AR1.23
MO7B
  Bottom 1.016: JP32.3 111.76,95.65 111.76,111.84 97.47,111.84 AR1.25
MO7P  (via drill 0.8 pad 1.93)  (1 unrouted)
  Top 1.016: v96.52,77.87 v114.3,77.87 | v96.52,70.25 v96.52,74.69
  Bottom 1.016: AR1.2 v96.52,70.25 | v114.3,77.87 114.3,93.11 106.68,93.11 106.68,98.19 JP32.2 | v96.52,74.69 96.52,77.23
N$1
  Bottom 1.016: R19.P$5 44.45,93.11 LED9.A
  Bottom 1.676: 45.72,93.11 44.45,93.11
N$2
  Bottom 1.016: 44.77,95.65 44.45,95.65 LED8.A
  Bottom 1.676: R18.P$5 44.77,95.65 | 45.72,95.65 44.45,95.65
N$3
  Bottom 1.676: R11.P$6 55.88,117.87 OK1.1
N$4
  Bottom 1.016: SW1.1 20.32,6.75 12.7,6.75 JP1.1
N$5
  Bottom 1.016: D1.C C3.1 C1.PLUS IC2.P$1 10.16,13.73 10.16,4.84 22.86,4.84 SW1.2
N$6
  Bottom 2.184: R2.2 Q1.1
N$8
  Bottom 2.184: R4.2 Q2.1
N$9
  Bottom 1.016: R17.P$5 44.45,98.19 LED7.A
  Bottom 1.676: 45.72,98.19 44.45,98.19
N$10
  Bottom 1.676: U$7.2 119.38,119.62 R3.P$6
N$11
  Bottom 2.184: U$7.6 124.46,132.32 129.54,132.32 R2.1
N$12
  Bottom 1.016: 63.18,120.57 OK2.1
  Bottom 1.676: 63.18,120.57 R12.P$6 OK2.1
N$13
  Bottom 1.676: R7.P$6 LED1.A
N$15
  Bottom 1.27: U$17.6 147.32,131.68 152.4,131.68 R4.1
  Bottom 2.184: U$17.6 147.32,132.32 152.4,132.32 R4.1
N$16
  Bottom 1.676: LEDBATTERY1.A R21.P$5
N$17
  Bottom 1.016: 44.45,100.73 33.02,92.47 LED6.A
  Bottom 1.676: R16.P$5 44.45,100.73
N$19
  Bottom 1.676: R6.P$6 LED2.A
N$20
  Bottom 1.676: R5.P$6 142.24,119.62 U$17.2
N$21
  Bottom 1.27: Q2.2 147.32,139.3 142.24,139.3 D2.A JP2.1
  Bottom 2.184: 134.62,138.19 134.62,137.4 D2.A 137.16,137.4 137.16,138.83 | 137.16,138.83 141.76,138.83 | 139.7,138.19 134.62,138.19 | 134.62,138.19 134.62,138.83 137.16,138.83
N$23
  Bottom 1.016: OK3.3 JP7.1
N$24
  Bottom 1.016: OK5.3 JP8.1
N$25
  Bottom 6.452: 170.18,129.46 157.16,129.46
N$26
  Bottom 1.016: OK1.3 JP4.1
N$27
  Bottom 1.016: 73.66,118.51 OK3.1
  Bottom 1.676: 73.66,118.51 R13.P$6
N$28
  Bottom 1.016: OK2.3 JP5.1
N$29
  Bottom 1.016: OK5.1 91.76,121.21 88.42,117.87 83.82,117.87 R15.P$6
N$30
  Bottom 1.016: OK6.3 JP9.1
N$31
  Bottom 1.016: R20.P$6 85.72,115.33 | 87.95,115.33 88.26,115.33 92.07,119.14 104.14,119.14 OK6.1
  Bottom 1.676: 87.95,115.33 85.72,115.33
N$32
  Bottom 1.016: OK4.3 JP6.1
N$34
  Bottom 1.016: R14.P$6 OK4.1
N$35
  Bottom 1.422: 173.83,89.93 173.82,89.94 169.88,89.94
N$36
  Bottom 1.27: Q1.2 124.46,139.3 119.38,139.3 D3.A
  Bottom 1.676: D3.A JP33.1
  Bottom 2.184: 119.38,137.08 119.38,136.45 | 119.38,136.45 119.38,135.02 114.3,135.02 114.3,137.4 | D3.A 114.3,137.4 | 114.3,137.4 114.3,138.83 114.46,138.83 | 114.46,138.83 119.06,138.83 | 114.46,138.83 114.46,136.45 119.38,136.45
N$40
  Bottom 1.676: R1.P$5 LEDBATTERY.A
N$41  (via drill 1 pad 2.18)
  other vias: 12.7,22.62
N$42  (via drill 1 pad 2.18)
  other vias: 19.05,22.62
N$43  (via drill 1 pad 2.18)
  other vias: 22.86,22.62
N$44  (via drill 1 pad 2.18)
  other vias: 29.05,22.62
N$45
  Bottom 0.305: 157.48,124.7 156.61,123.75 | 156.61,123.75 156.61,115.33 | 156.61,123.75 151.53,123.76
N$46
  Bottom 0.305: 167.64,117.87 168.5,117.87 168.5,125.65 166.58,125.65 166.54,125.68 145.54,125.68 145.51,125.65
N$47
  Bottom 0.813: 167.66,124.7 168.13,124.7 168.16,124.73 168.16,125.17 166.94,125.17 166.86,125.25 166.99,125.25 168.2,124.05
N$48
  Bottom 1.27: 170.18,117.87 169.81,117.87 | 169.81,117.87 169.81,117.92 | 169.81,117.92 169.81,126.87 170.18,127.24 | 170.26,117.9 169.83,117.9 169.81,117.92 | 169.81,117.87 169.81,5.87
N$49
  Bottom 1.27: 172.53,6.14 175.58,6.14
N$50
  Bottom 6.452: 127,12.46 127,112.47 127.16,112.63
N$51
  Bottom 1.016: LED3.A 35.56,136.29 27.4,136.21 XB1.18
N$52
  Bottom 1.676: 121.92,112.79 121.76,112.79 121.76,115.49 155.1,115.49 155.1,6.27
N$53
  Bottom 1.676: 121.92,59.45 121.76,59.45 121.76,5.16 155.26,5.16
N$54
  Bottom 1.016: R8.2 LED3.K
N$55
  Bottom 1.676: 157.48,59.45 157.32,59.45 157.32,8.18 167.8,8.18 167.8,116.92 166.69,118.03
N$56
  Bottom 1.676: 84.77,112.79 85.09,112.79
N$57  (via drill 0.8 pad 2.18)
  other vias: 24.45,112.16
N$58
  Bottom 3.048: 22.86,67.71 22.86,66.44
N$59
  Bottom 1.016: JP6.2 JP7.2 JP5.2 JP4.2 53.34,136.45 | OK4.4 83.82,126.29
  Bottom 2.184: C8.1 43.18,126.29 | SW5.2 43.18,126.29 | 43.18,126.29 R21.P$6 53.34,126.29 | JP9.2 JP8.2 JP6.2 53.34,136.45 OK1.4 53.34,126.29 | 53.34,126.29 63.5,126.29 | 63.5,126.29 73.66,126.29 | 73.66,126.29 83.82,126.29 | 83.82,126.29 93.98,126.29 | 93.98,126.29 104.14,126.29 OK6.4 | OK5.4 93.98,126.29 | 83.82,128.83 83.82,126.29 | OK3.4 73.66,126.29 | OK2.4 63.5,126.29
N$64
  Bottom 1.676: 77.47,117.87 77.47,118.51 78.1,118.51
N$65
  Bottom 1.676: 77.47,115.33 77.47,114.06
N$68
  Bottom 1.016: XB1.3 16.92,117.17 18.26,118.51 R10.2 R9.2
N$81
  Bottom 1.016: SW5.1 40.48,134.86 JP24.1
  Bottom 2.184: JP24.1 40.77,135.59 40.77,133.37 40.77,128.9
N$103
  Bottom 1.016: R41.1 35.56,117.4 35.4,118.19 30,126.13 TR1.B
N$104
  Bottom 1.016: XB1.2 14.92,117.71 TR1.E
RIMIT1
  Bottom 1.016: AR1.A4 38.1,62.63 JP3.2
RIMIT2
  Bottom 1.016: AR1.A5 36.19,63.26 36.19,6.75 JP3.1
RIMIT3
  Bottom 1.016: AR1.A6 34.29,64.53 34.29,4.84 40.64,4.84 JP3.3
RIMIT4
  Bottom 1.016: AR1.A7 32.38,65.8 32.38,3.41 43.18,3.41 JP3.5
RIMIT5
  Bottom 1.016: AR1.46 66.04,18.81 59.05,11.83 59.05,3.41 48.26,3.41 JP3.9
RIMIT6
  Bottom 1.016: AR1.48 63.5,18.81 57.15,12.46 57.15,4.84 50.8,4.84 JP3.11
RIMIT7
  Bottom 1.016: AR1.50 60.96,18.81 55.25,13.1 55.25,6.75 JP3.13
RIMIT8
  Bottom 1.016: AR1.52 58.42,18.81 53.34,13.73 JP3.14
RS
  Bottom 1.016: AR1.44 68.58,16.91 63.5,11.83 JP26.4
RXD  (via drill 0.8 pad 1.93)
  Top 1.016: v96.52,88.03 v53.34,88.03
  Bottom 1.016: AR1.17 v96.52,88.03 | v53.34,88.03 52.39,107.39 40.64,107.08 R43.1 33.02,104.22 33.02,117.87 29.37,123.75 TR1.C 18.26,123.59
SERVO1
  Bottom 1.016: AR1.53 58.42,114.06
  Bottom 1.676: R11.P$5 58.42,114.06
SERVO2
  Bottom 1.016: 60.96,114.06 AR1.51
  Bottom 1.676: R12.P$5 60.96,114.06
SERVO3
  Bottom 1.016: AR1.49 63.5,115.33 73.02,115.33
  Bottom 1.676: R13.P$5 73.02,115.33
SERVO4
  Bottom 1.016: AR1.47 66.04,113.43 77.47,113.43 R14.P$5
SERVO5
  Bottom 1.016: AR1.45 68.58,111.84 81.28,111.84 R15.P$5
SERVO6
  Bottom 1.016: AR1.43 71.12,110.25 83.82,110.25 R20.P$5
TACT1  (3 unrouted)
  Bottom 1.016: AR1.A9 45.24,82.79 37.31,75.01 27.94,67.07 22.86,67.07
  Bottom 3.048: 22.86,80.41 22.86,79.14
TOGLE1
  Bottom 1.016: SW3.1 22.86,59.45 25.4,59.45 25.4,61.99 40.16,75.01 48.1,83.11 AR1.A8
TOGLE2
  Bottom 1.016: SW2.1 20.32,64.53 20.32,70.72 27.94,70.72 36.99,77.39 40,80.09 AR1.A10
TXD  (via drill 1 pad 1.93)
  Top 1.016: v96.52,82.95 v50.8,82.95
  Bottom 1.016: R9.1 30.64,128.67 37.62,118.82 38.1,112.79 38.1,110.25 53.66,110.25 55.09,88.19 55.09,82.95 v50.8,82.95 | AR1.16 96.52,85.49 v96.52,82.95